# EAGLE design toaster_brain (EAGLE 5.11)
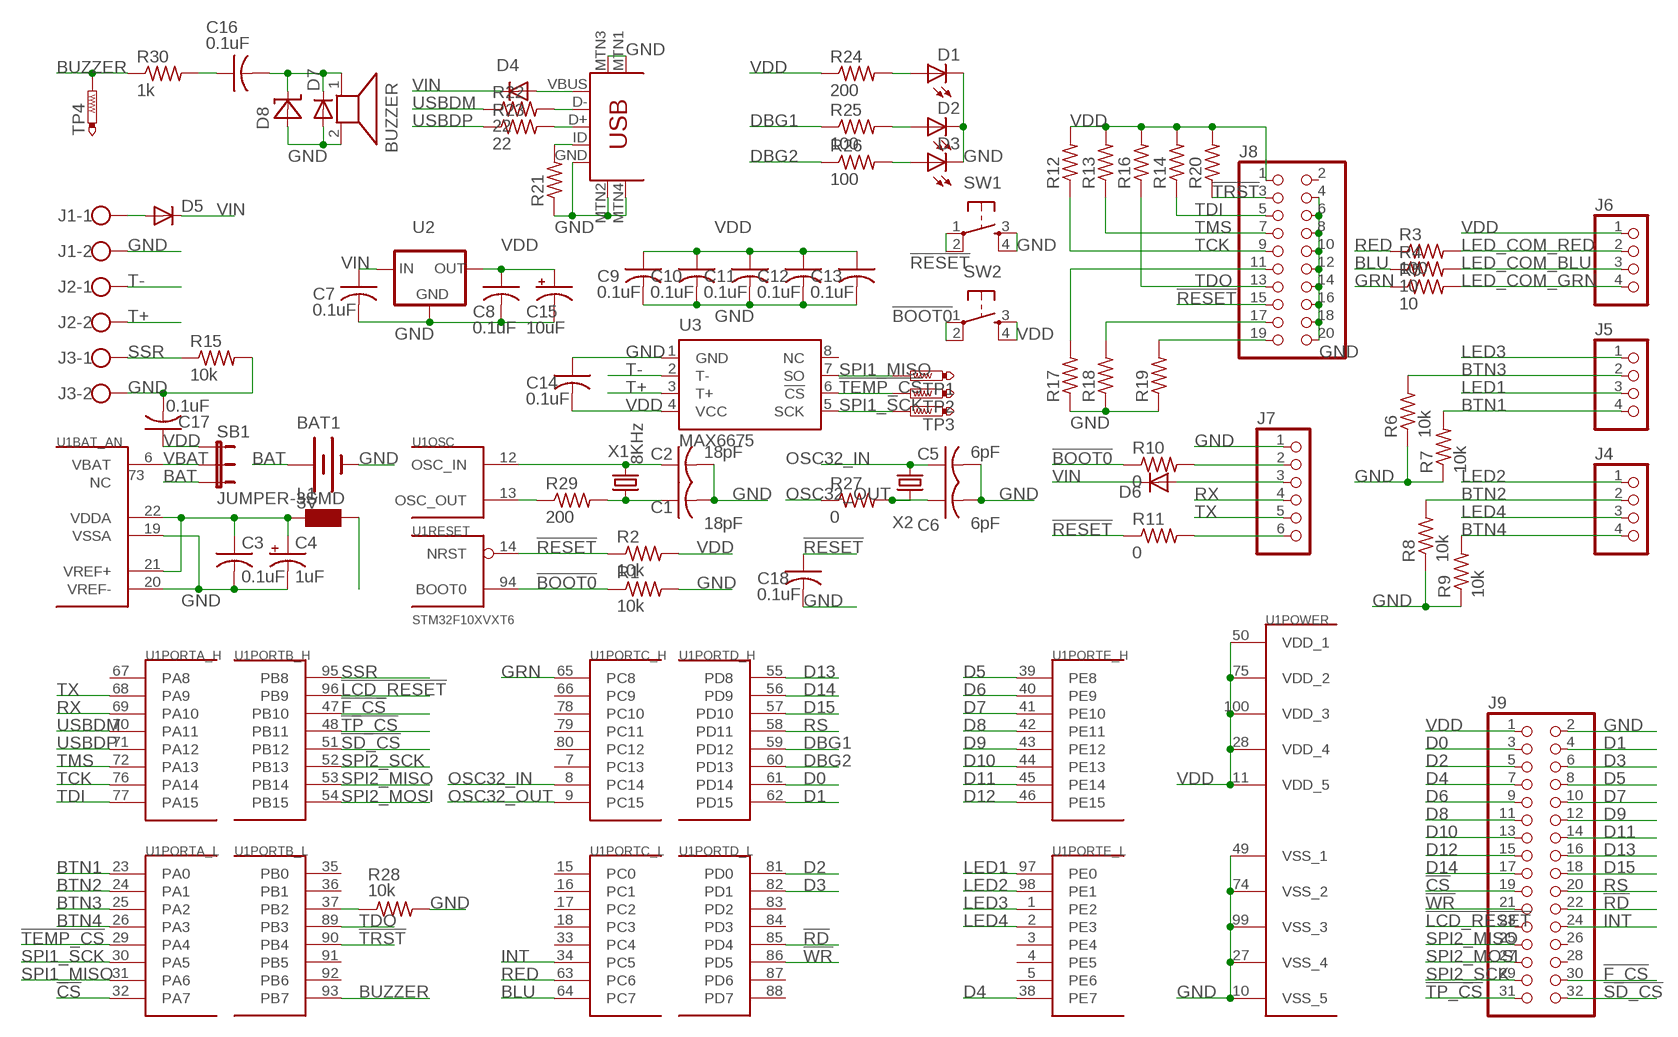
[diagram p0: schematic, sheet 1]

## Parts
BAT1  3V  BATTERY12MM  [BATTCON_12MM]
BUZZER  AST1628MATRQ  [AST1628MATRQ]
C1  18pF  C-USC0603  [C0603]
C2  18pF  C-USC0603  [C0603]
C3  0.1uF  C-USC0603  [C0603]
C4  1uF  CPOL-USSMCP  [SMC_P]
C5  6pF  C-USC0603  [C0603]
C6  6pF  C-USC0603  [C0603]
C7  0.1uF  C-USC0603  [C0603]
C8  0.1uF  C-USC0603  [C0603]
C9  0.1uF  C-USC0603  [C0603]
C10  0.1uF  C-USC0603  [C0603]
C11  0.1uF  C-USC0603  [C0603]
C12  0.1uF  C-USC0603  [C0603]
C13  0.1uF  C-USC0603  [C0603]
C14  0.1uF  C-USC0603  [C0603]
C15  10uF  CPOL-USB/3528-21R  [B/3528-21R]
C16  0.1uF  C-USC0603  [C0603]
C17  0.1uF  C-USC0603  [C0603]
C18  0.1uF  C-USC0603  [C0603]
D1  LEDCHIP-LED0603  [CHIP-LED0603]
D2  LEDCHIP-LED0603  [CHIP-LED0603]
D3  LEDCHIP-LED0603  [CHIP-LED0603]
D4  DIODE-SOD323-R  [SOD323-R]
D5  DIODE-SOD323-R  [SOD323-R]
D6  DIODE-SOD323-R  [SOD323-R]
D7  DIODE-SOD123  [SOD123]
D8  ZDIODE  [SOD123@2]
J1  W237-102  [W237-102]
J2  W237-102  [W237-102]
J3  W237-102  [W237-102]
J4  PINHD-1X4  [1X04]
J5  PINHD-1X4  [1X04]
J6  PINHD-1X4  [1X04]
J7  PINHD-1X6  [1X06]
J8  PINHD-2X10  [2X10]
J9  PINHD-2X16  [2X16]
J10  USB-MINIB-5PIN  [USB-MINIB]
L1  WE-CBF_0603  [0603]
R1  10k  R-US_R0603  [R0603]
R2  10k  R-US_R0603  [R0603]
R3  100  R-US_R0603  [R0603]
R4  10  R-US_R0603  [R0603]
R5  10  R-US_R0603  [R0603]
R6  10k  R-US_R0603  [R0603]
R7  10k  R-US_R0603  [R0603]
R8  10k  R-US_R0603  [R0603]
R9  10k  R-US_R0603  [R0603]
R10  0  R-US_R0603  [R0603]
R11  0  R-US_R0603  [R0603]
R12  10k  R-US_R0603  [R0603]
R13  10k  R-US_R0603  [R0603]
R14  10k  R-US_R0603  [R0603]
R15  10k  R-US_R0603  [R0603]
R16  10k  R-US_R0603  [R0603]
R17  10k  R-US_R0603  [R0603]
R18  10k  R-US_R0603  [R0603]
R19  10k  R-US_R0603  [R0603]
R20  10k  R-US_R0603  [R0603]
R21  10k  R-US_R0603  [R0603]
R22  22  R-US_R0603  [R0603]
R23  22  R-US_R0603  [R0603]
R24  200  R-US_R0603  [R0603]
R25  100  R-US_R0603  [R0603]
R26  100  R-US_R0603  [R0603]
R27  0  R-US_R0603  [R0603]
R28  10k  R-US_R0603  [R0603]
R29  200  R-US_R0603  [R0603]
R30  1k  R-US_R0603  [R0603]
SB1  JUMPER-3SMD  [SJ_3]
SW1  TAC_SWITCHSMD  [TACTILE_SWITCH_SMD]
SW2  TAC_SWITCHSMD  [TACTILE_SWITCH_SMD]
TP1  PTR1TP07R  [TP07R]
TP2  PTR1TP07R  [TP07R]
TP3  PTR1TP07R  [TP07R]
TP4  PTR1TP07R  [TP07R]
U1  STM32F10XVXT6  [TQFP100]
U2  LP2950CDT-3.3  [DPACK]
U3  MAX6675  [SO08]
X1  8KHz  CRYSTALCTS406  [CTS406]
X2  MC-306  [MC-306]

## Nets
!BOOT0: R1.1 R10.1 SW2.1 SW2.2 U1.94(RESET:BOOT0)
!CS: J9.19 U1.32(PORTA_L:PA7)
!F_CS: J9.30 U1.47(PORTB_H:PB10)
!LCD_RESET: J9.23 U1.96(PORTB_H:PB9)
!RD: J9.22 U1.85(PORTD_L:PD4)
!RESET: C18.1 J8.15 R2.1 R11.1 SW1.1 SW1.2 U1.14(RESET:NRST)
!SD_CS: J9.32 U1.51(PORTB_H:PB12)
!TEMP_CS: TP2.TP U1.29(PORTA_L:PA4) U3.6(!CS)
!TP_CS: J9.31 U1.48(PORTB_H:PB11)
!TRST: J8.3 R20.1 U1.90(PORTB_L:PB4)
!WR: J9.21 U1.86(PORTD_L:PD5)
BAT: BAT1.PWR@1(+) SB1.3
BLU: R4.1 U1.64(PORTC_L:PC7)
BTN1: J5.4 R7.2 U1.23(PORTA_L:PA0)
BTN2: J4.2 R8.2 U1.24(PORTA_L:PA1)
BTN3: J5.2 R6.2 U1.25(PORTA_L:PA2)
BTN4: J4.4 R9.2 U1.26(PORTA_L:PA3)
BUZZER: R30.1 TP4.TP U1.93(PORTB_L:PB7)
D0: J9.3 U1.61(PORTD_H:PD14)
D1: J9.4 U1.62(PORTD_H:PD15)
D2: J9.5 U1.81(PORTD_L:PD0)
D3: J9.6 U1.82(PORTD_L:PD1)
D4: J9.7 U1.38(PORTE_L:PE7)
D5: J9.8 U1.39(PORTE_H:PE8)
D6: J9.9 U1.40(PORTE_H:PE9)
D7: J9.10 U1.41(PORTE_H:PE10)
D8: J9.11 U1.42(PORTE_H:PE11)
D9: J9.12 U1.43(PORTE_H:PE12)
D10: J9.13 U1.44(PORTE_H:PE13)
D11: J9.14 U1.45(PORTE_H:PE14)
D12: J9.15 U1.46(PORTE_H:PE15)
D13: J9.16 U1.55(PORTD_H:PD8)
D14: J9.17 U1.56(PORTD_H:PD9)
D15: J9.18 U1.57(PORTD_H:PD10)
DBG1: R25.1 U1.59(PORTD_H:PD12)
DBG2: R26.1 U1.60(PORTD_H:PD13)
GND: BAT1.GND(-) BUZZER.2 C1.2 C2.2 C3.2 C4.- C5.2 C6.2 C7.2 C8.2 C9.2 C10.2 C11.2 C12.2 C13.2 C14.1 C15.- C17.2 C18.2 D1.C D2.C D3.C D7.A D8.A J1.2 J3.2 J7.1 J8.4 J8.6 J8.8 J8.10 J8.12 J8.14 J8.16 J8.18 J8.20 J9.2 J10.GND J10.MTN1(MTN2) J10.MTN2(MTN3) J10.MTN3(MTN1) J10.MTN4 R1.2 R6.1 R7.1 R8.1 R9.1 R15.2 R17.1 R18.1 R19.1 R21.1 R28.2 SW1.3 SW1.4 U1.10(POWER:VSS_5) U1.19(BAT_AN:VSSA) U1.20(BAT_AN:VREF-) U1.27(POWER:VSS_4) U1.49(POWER:VSS_1) U1.74(POWER:VSS_2) U1.99(POWER:VSS_3) U2.4(GND) U3.1(GND)
GRN: R5.1 U1.65(PORTC_H:PC8)
INT: J9.24 U1.34(PORTC_L:PC5)
LED1: J5.3 U1.97(PORTE_L:PE0)
LED2: J4.1 U1.98(PORTE_L:PE1)
LED3: J5.1 U1.1(PORTE_L:PE2)
LED4: J4.3 U1.2(PORTE_L:PE3)
LED_COM_BLU: J6.3 R4.2
LED_COM_GRN: J6.4 R5.2
LED_COM_RED: J6.2 R3.2
N$1: C1.1 R29.2 X1.1
N$2: C2.1 U1.12(OSC:OSC_IN) X1.3
N$3: J7.2 R10.2
N$4: J7.6 R11.2
N$6: J8.11 R17.2
N$7: J8.17 R18.2
N$8: J8.19 R19.2
N$9: J10.ID R21.2
N$10: J10.D- R22.2
N$11: J10.D+ R23.2
N$13: D1.A R24.2
N$14: D2.A R25.2
N$15: D3.A R26.2
N$16: C6.1 R27.2 X2.1
N$19: R28.1 U1.37(PORTB_L:PB2)
N$20: D4.A J10.VBUS
N$21: D5.A J1.1
N$22: D6.A J7.3
N$23: R29.1 U1.13(OSC:OSC_OUT)
N$24: C16.1 R30.2
N$25: C3.1 C4.+ L1.1 U1.21(BAT_AN:VREF+) U1.22(BAT_AN:VDDA)
N$27: BUZZER.1 C16.2 D7.C D8.C
OSC32_IN: C5.1 U1.8(PORTC_H:PC14) X2.4
OSC32_OUT: R27.1 U1.9(PORTC_H:PC15)
RED: R3.1 U1.63(PORTC_L:PC6)
RS: J9.20 U1.58(PORTD_H:PD11)
RX: J7.4 U1.69(PORTA_H:PA10)
SPI1_MISO: TP1.TP U1.31(PORTA_L:PA6) U3.7(SO)
SPI1_SCK: TP3.TP U1.30(PORTA_L:PA5) U3.5(SCK)
SPI2_MISO: J9.25 U1.53(PORTB_H:PB14)
SPI2_MOSI: J9.27 U1.54(PORTB_H:PB15)
SPI2_SCK: J9.29 U1.52(PORTB_H:PB13)
SSR: J3.1 R15.1 U1.95(PORTB_H:PB8)
T+: J2.2 U3.3(T+)
T-: J2.1 U3.2(T-)
TCK: J8.9 R12.1 U1.76(PORTA_H:PA14)
TDI: J8.5 R14.1 U1.77(PORTA_H:PA15)
TDO: J8.13 R16.1 U1.89(PORTB_L:PB3)
TMS: J8.7 R13.1 U1.72(PORTA_H:PA13)
TX: J7.5 U1.68(PORTA_H:PA9)
USBDM: R22.1 U1.70(PORTA_H:PA11)
USBDP: R23.1 U1.71(PORTA_H:PA12)
VBAT: SB1.2 U1.6(BAT_AN:VBAT)
VDD: C8.1 C9.1 C10.1 C11.1 C12.1 C13.1 C14.2 C15.+ C17.1 J6.1 J8.1 J9.1 L1.2 R2.2 R12.2 R13.2 R14.2 R16.2 R20.2 R24.1 SB1.1 SW2.3 SW2.4 U1.11(POWER:VDD_5) U1.28(POWER:VDD_4) U1.50(POWER:VDD_1) U1.75(POWER:VDD_2) U1.100(POWER:VDD_3) U2.3(OUT) U3.4(VCC)
VIN: C7.1 D4.C D5.C D6.C U2.1(IN)
Unconnected: J8.2 J9.26 J9.28 U1.3(PORTE_L:PE4) U1.4(PORTE_L:PE5) U1.5(PORTE_L:PE6) U1.7(PORTC_H:PC13) U1.15(PORTC_L:PC0) U1.16(PORTC_L:PC1) U1.17(PORTC_L:PC2) U1.18(PORTC_L:PC3) U1.33(PORTC_L:PC4) U1.35(PORTB_L:PB0) U1.36(PORTB_L:PB1) U1.66(PORTC_H:PC9) U1.67(PORTA_H:PA8) U1.73(BAT_AN:NC) U1.78(PORTC_H:PC10) U1.79(PORTC_H:PC11) U1.80(PORTC_H:PC12) U1.83(PORTD_L:PD2) U1.84(PORTD_L:PD3) U1.87(PORTD_L:PD6) U1.88(PORTD_L:PD7) U1.91(PORTB_L:PB5) U1.92(PORTB_L:PB6) U3.8(NC)

## Library data of the parts
BAT1 = SparkFun:BATTERY: Battery Holders Various common sizes : AA, AAA, 20mm coin cell and 12mm coin cell.
BUZZER = piezo:AST1628MATRQ: Audio Indicators & Alerts 3MM HEIGHT 4000HZ 85DB Datasheet <http://www.mallory-sonalert.com/specifications/AST1628MATRQ.pdf>
C1-C3 C5-C14 C16-C18 = rcl:C-US: CAPACITOR, American symbol
C4 C15 = rcl:CPOL-US: POLARIZED CAPACITOR, American symbol
D1-D3 = led:LED: LED OSRAM: - CHIPLED LG R971, LG N971, LY N971, LG Q971, LY Q971, LO R971, LY R971 LH N974, LH R974 LS Q976, LO Q976, LY Q976 LO Q996 - Hyper CHIPLED LW Q18S LB Q993, LB Q99A, LB R99A - SideLED LS A670, LO A670, LY A670, LG A670, LP A670 LB A673, LV A673, LT A673, LW A673 LH A674 LY A675 LS A676, LA A676, LO A676, LY A676, LW A676 LS A679, LY A679, LG A679 - Hyper Micro SIDELED® LS Y876, LA Y876, LO Y876, LY Y876 LT Y87S - SmartLED LW L88C, LW L88S LB L89C, LB L89S, LG L890 LS L89K, LO L89K, LY L89K LS L896, LA L896, LO L896, LY L896 - TOPLED LS T670, LO T670, LY T670, LG T670, LP T670 LSG T670, LSP T670, LSY T670, LOP T670, LYG T670 LG T671, LOG T671, LSG T671 LB T673, LV T673, LT T673, LW T673 LH T674 LS T676, LA T676, LO T676, LY T676, LB T676, LH T676, LSB T676, LW T676 LB T67C, LV T67C, LT T67C, LS T67K, LO T67K, LY T67K, LW E67C LS E67B, LA E67B, LO E67B, LY E67B, LB E67C, LV E67C, LT E67C LW T67C LS T679, LY T679, LG T679 LS T770, LO T770, LY T770, LG T770, LP T770 LB T773, LV T773, LT T773, LW T773 LH T774 LS E675, LA E675, LY E675, LS T675 LS T776, LA T776, LO T776, LY T776, LB T776 LHGB T686 LT T68C, LB T68C - Hyper Mini TOPLED® LB M676 - Mini TOPLED Santana® LG M470 LS M47K, LO M47K, LY M47K Source: http://www.osram.convergy.de LUXEON: - LUMILED® LXK2-PW12-R00, LXK2-PW12-S00, LXK2-PW14-U00, LXK2-PW14-V00 LXK2-PM12-R00, LXK2-PM12-S00, LXK2-PM14-U00 LXK2-PE12-Q00, LXK2-PE12-R00, LXK2-PE12-S00, LXK2-PE14-T00, LXK2-PE14-U00 LXK2-PB12-K00, LXK2-PB12-L00, LXK2-PB12-M00, LXK2-PB14-N00, LXK2-PB14-P00, LXK2-PB14-Q00 LXK2-PR12-L00, LXK2-PR12-M00, LXK2-PR14-Q00, LXK2-PR14-R00 LXK2-PD12-Q00, LXK2-PD12-R00, LXK2-PD12-S00 LXK2-PH12-R00, LXK2-PH12-S00 LXK2-PL12-P00, LXK2-PL12-Q00, LXK2-PL12-R00 Source: www.luxeon.com KINGBRIGHT: KA-3528ASYC Source: www.kingbright.com
D4-D7 = diode:DIODE-: DIODE
D8 = diode:ZDIODE
J1-J3 = con-wago-500:W237-102: WAGO SCREW CLAMP; MPN: 237-102; OC_FARNELL: unknown; OC_NEWARK: 70K9898
J4-J6 = pinhead:PINHD-1X4: PIN HEADER
J7 = pinhead:PINHD-1X6: PIN HEADER
J8 = pinhead:PINHD-2X10: PIN HEADER
J9 = pinhead:PINHD-2X16: PIN HEADER
J10 = SparkFun:USB-MINIB: Mini-USB "B" connector with 5th pin broken out. Created new symbol breaking out 5th "ID" pin in mini/micro USB connector spec. See: http://en.wikipedia.org/wiki/Mini_usb#Cables. Uses same footprint as 4-pin symbol. Also added pins to connect to mounting / shield pads if required (probably not generally needed as signals aren't shielded once they leave the connector).
L1 = wuerth-elektronik:WE-CBF: SMD EMI Suppression Ferrite Beads - excellent anti-EMI properties - low DCR - impedances till 3000 ohms - rated current up to 6 A
R1-R30 = resistor:R-US_: RESISTOR, American symbol
SB1 = SparkFun:JUMPER-3
SW1 SW2 = SparkFun:TAC_SWITCH: Momentary Switch Button commonly used for reset or general input. Spark Fun Electronics SKU : COM-00097
TP1-TP4 = testpad:PTR1: TEST PIN
U1 = stm32:STM32F10XVXT6: STM32F101/103 100 pin LQFP
U2 = v-reg:LP2950?*: Source: http://cache.national.com/ds/LP/LP2950.pdf
U3 = maxim:MAX6675
X1 = crystal:CRYSTAL: CRYSTAL; OC_FARNELL: unknown; OC_NEWARK: unknown
X2 = crystal:MC-306: kHz RANGE CRYSTAL UNIT SMD Source: MC-306_405_406_E07X.PDF Homepage <www.epsontoyocom.co.jp>; MPN: MC-306 60.0KHZ 100PPM ,12.5PF; OC_FARNELL: 1278040; OC_NEWARK: 31M5576

## Board
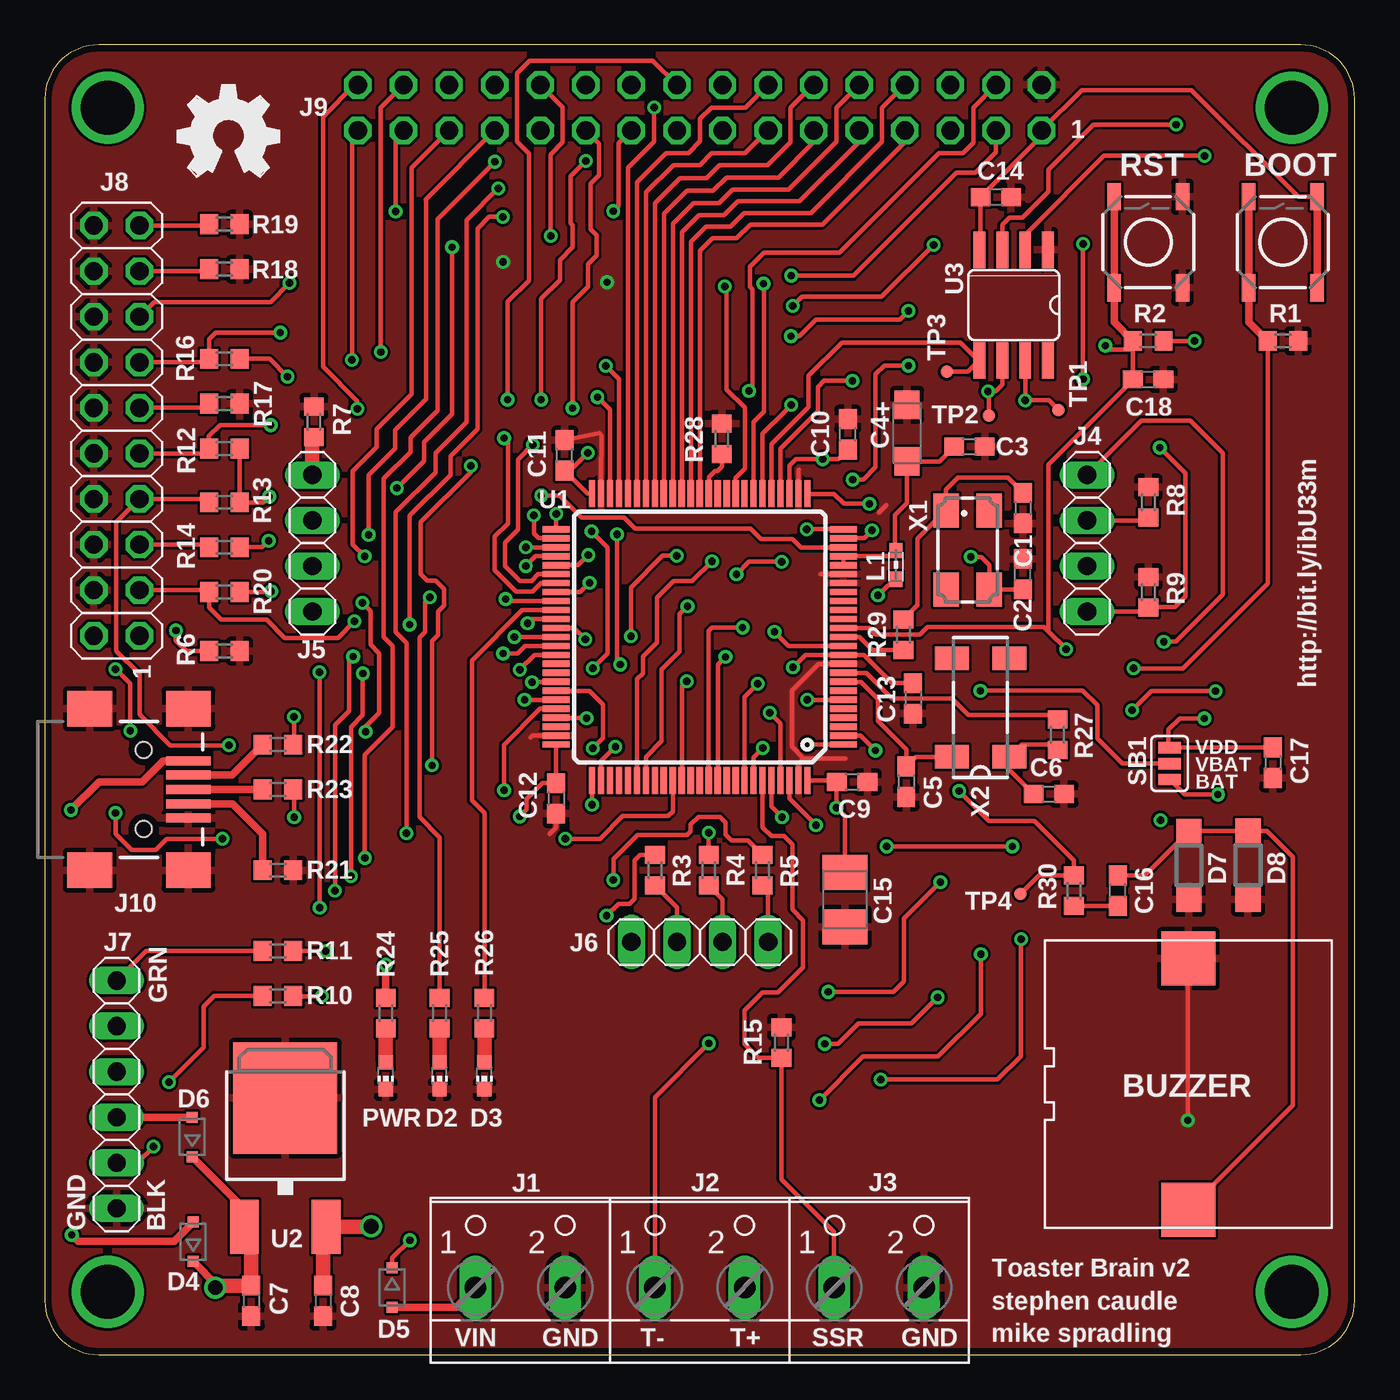
[diagram p1: board, top side]
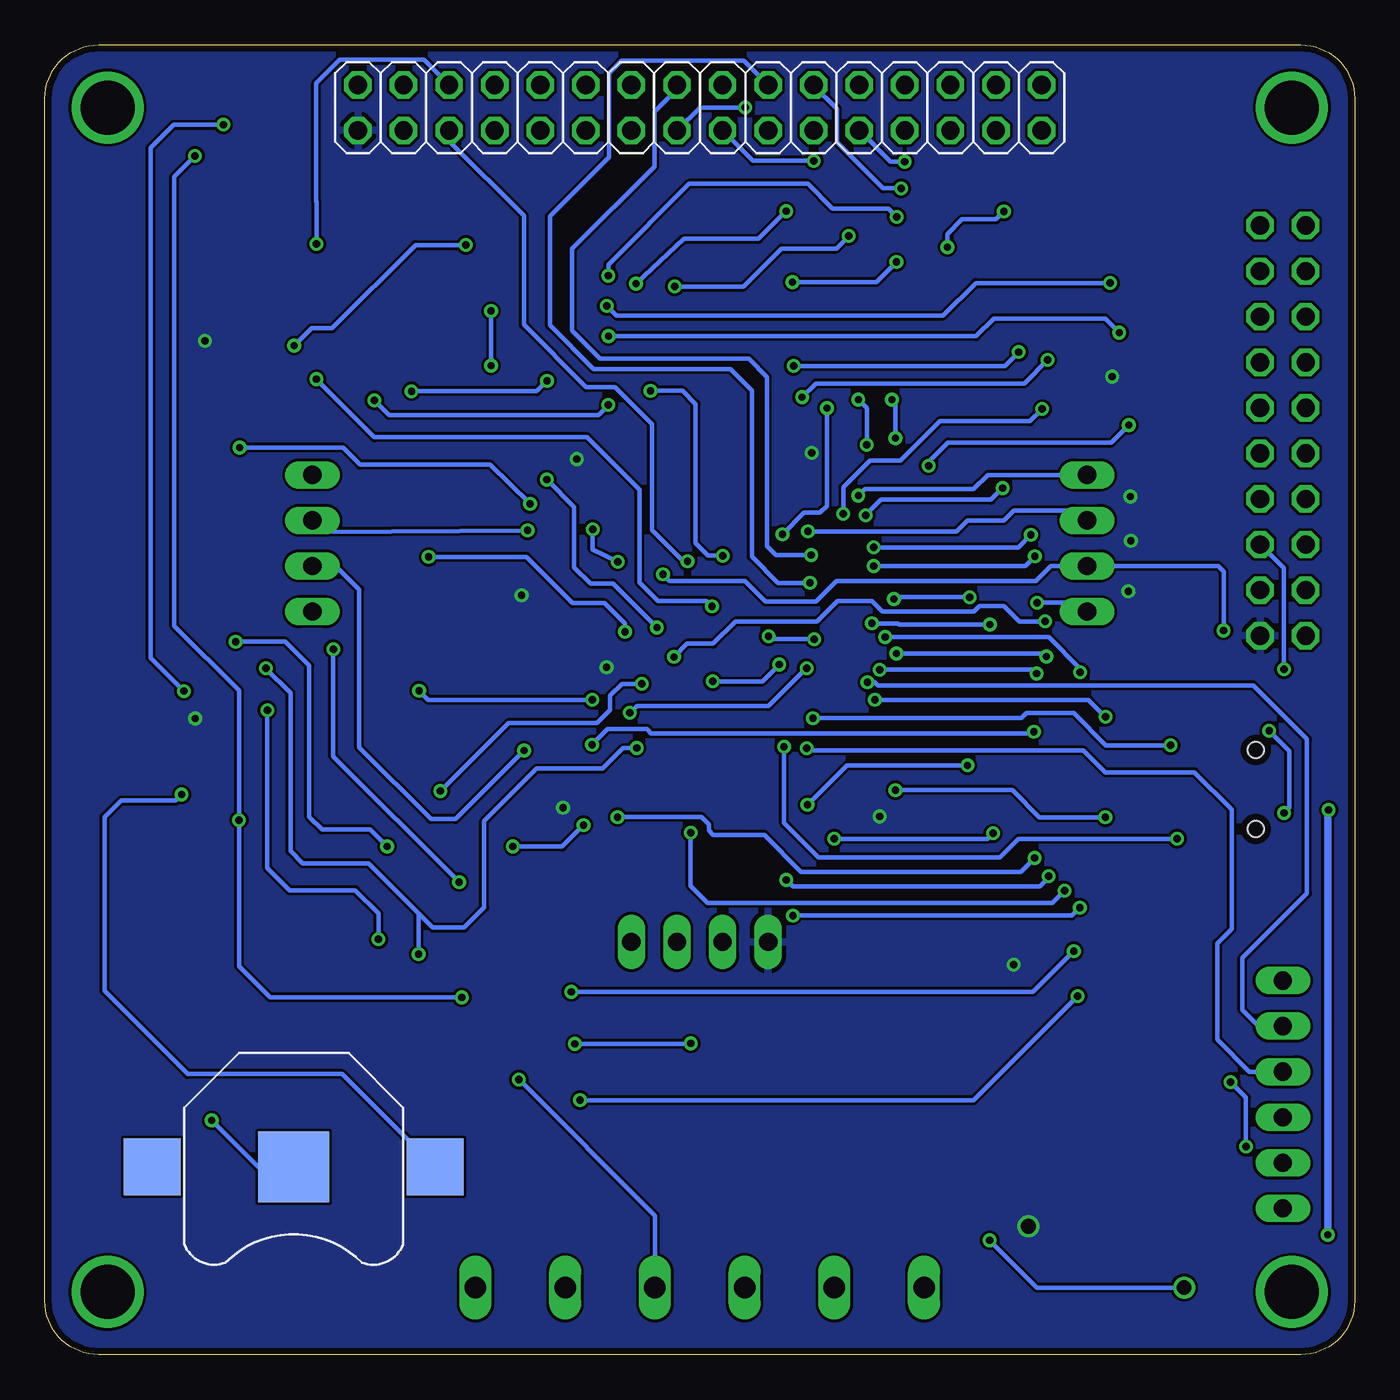
[diagram p2: board, bottom side, seen from below]

Size 73 x 73 mm. Coordinates in mm from the lower left corner, seen from the top.
Outline: 70,0 arc90 73,3 73,70 arc90 70,73 3,73 arc90 0,70 0,3 arc90 3,0 70,0
Copper layers (1*16): Top 0.0356mm / dielectric 1.5011mm / Bottom 0.0356mm
Design rules "LaenPCBOrder *": minimum track width 6mil, minimum drill 13mil, track to track 6mil, track to pad 6mil, pad to pad 6mil, via to via 6mil, smd to smd 6mil, copper to edge 15mil, drill to drill 6mil, minimum pad ring 7mil, minimum via ring 7mil, stop-mask expansion 4mil, vias tented up to drill 18mil, thermal gap 10mil

### Footprints (pad centres in the part's own frame; a part is rotated, then mirrored left to right if it is on the bottom)
BATTCON_12MM = smd 3.962 x 3.962: GND 0,0 | smd 3.175 x 3.175: PWR@1 -7.874,0; PWR@2 7.874,0
AST1628MATRQ = smd 3 x 3: 1 0,7; 2 0,-7
C0603 = smd 1.1 x 1: 1 -0.85,0; 2 0.85,0
SMC_P = smd 1.6 x 1.4: + -1.575,0; - 1.575,0
B/3528-21R = smd 1.95 x 2.5: + 1.525,0; - -1.525,0
CHIP-LED0603 = smd 0.8 x 0.8: A 0,-0.75; C 0,0.75
SOD323-R = smd 0.6 x 0.6: A 1.1,0; C -1.1,0
SOD123 = smd 1.4 x 1.4: A 1.9,0; C -1.9,0
SOD123@2 = smd 1.4 x 1.4: A 1.9,0; C -1.9,0
W237-102 = drill 1.194 long: 1 -2.5,-1.27; 2 2.5,-1.27
1X04 = drill 1.016 long: 1 -3.81,0; 2 -1.27,0; 3 1.27,0; 4 3.81,0
1X06 = drill 1.016 long: 1 -6.35,0; 2 -3.81,0; 3 -1.27,0; 4 1.27,0; 5 3.81,0; 6 6.35,0
2X10 = drill 1.016 octagon: 1 -11.43,-1.27; 2 -11.43,1.27; 3 -8.89,-1.27; 4 -8.89,1.27; 5 -6.35,-1.27; 6 -6.35,1.27; 7 -3.81,-1.27; 8 -3.81,1.27; 9 -1.27,-1.27; 10 -1.27,1.27; 11 1.27,-1.27; 12 1.27,1.27; 13 3.81,-1.27; 14 3.81,1.27; 15 6.35,-1.27; 16 6.35,1.27; 17 8.89,-1.27; 18 8.89,1.27; 19 11.43,-1.27; 20 11.43,1.27
2X16 = drill 1.016 octagon: 1 -19.05,-1.27; 2 -19.05,1.27; 3 -16.51,-1.27; 4 -16.51,1.27; 5 -13.97,-1.27; 6 -13.97,1.27; 7 -11.43,-1.27; 8 -11.43,1.27; 9 -8.89,-1.27; 10 -8.89,1.27; 11 -6.35,-1.27; 12 -6.35,1.27; 13 -3.81,-1.27; 14 -3.81,1.27; 15 -1.27,-1.27; 16 -1.27,1.27; 17 1.27,-1.27; 18 1.27,1.27; 19 3.81,-1.27; 20 3.81,1.27; 21 6.35,-1.27; 22 6.35,1.27; 23 8.89,-1.27; 24 8.89,1.27; 25 11.43,-1.27; 26 11.43,1.27; 27 13.97,-1.27; 28 13.97,1.27; 29 16.51,-1.27; 30 16.51,1.27; 31 19.05,-1.27; 32 19.05,1.27
USB-MINIB = smd 2.5 x 0.5: D+ 2.5,0; D- 2.5,0.8; GND 2.5,-1.6; ID 2.5,-0.8; VBUS 2.5,1.6 | smd 2.5 x 2: MTN1 -3,4.5; MTN2 2.5,4.5; MTN3 -3,-4.5; MTN4 2.5,-4.5 | hole 0.9: 0,2.2; 0,-2.2
0603 = smd 0.85 x 0.7: 1 -0.9,0; 2 0.7,0
R0603 = smd 1 x 1.1: 1 -0.85,0; 2 0.85,0
SJ_3 = smd 0.635 x 1.27: 1 -0.889,0; 2 0,0; 3 0.889,0
TACTILE_SWITCH_SMD = smd 1.524 x 0.762: 1 -2.54,1.905; 2 2.54,1.905; 3 -2.54,-1.905; 4 2.54,-1.905
TP07R = smd 0.7 x 0.7: TP 0,0
TQFP100 = smd 1.5 x 0.347: 1 -8,6; 2 -8,5.5; 3 -8,5; 4 -8,4.5; 5 -8,4; 6 -8,3.5; 7 -8,3; 8 -8,2.5; 9 -8,2; 10 -8,1.5; 11 -8,1; 12 -8,0.5; 13 -8,0; 14 -8,-0.5; 15 -8,-1; 16 -8,-1.5; 17 -8,-2; 18 -8,-2.5; 19 -8,-3; 20 -8,-3.5; 21 -8,-4; 22 -8,-4.5; 23 -8,-5; 24 -8,-5.5; 25 -8,-6; 51 8,-6; 52 8,-5.5; 53 8,-5; 54 8,-4.5; 55 8,-4; 56 8,-3.5; 57 8,-3; 58 8,-2.5; 59 8,-2; 60 8,-1.5; 61 8,-1; 62 8,-0.5; 63 8,0; 64 8,0.5; 65 8,1; 66 8,1.5; 67 8,2; 68 8,2.5; 69 8,3; 70 8,3.5; 71 8,4; 72 8,4.5; 73 8,5; 74 8,5.5; 75 8,6 | smd 0.347 x 1.5: 26 -6,-8; 27 -5.5,-8; 28 -5,-8; 29 -4.5,-8; 30 -4,-8; 31 -3.5,-8; 32 -3,-8; 33 -2.5,-8; 34 -2,-8; 35 -1.5,-8; 36 -1,-8; 37 -0.5,-8; 38 0,-8; 39 0.5,-8; 40 1,-8; 41 1.5,-8; 42 2,-8; 43 2.5,-8; 44 3,-8; 45 3.5,-8; 46 4,-8; 47 4.5,-8; 48 5,-8; 49 5.5,-8; 50 6,-8; 76 6,8; 77 5.5,8; 78 5,8; 79 4.5,8; 80 4,8; 81 3.5,8; 82 3,8; 83 2.5,8; 84 2,8; 85 1.5,8; 86 1,8; 87 0.5,8; 88 0,8; 89 -0.5,8; 90 -1,8; 91 -1.5,8; 92 -2,8; 93 -2.5,8; 94 -3,8; 95 -3.5,8; 96 -4,8; 97 -4.5,8; 98 -5,8; 99 -5.5,8; 100 -6,8
DPACK = smd 1.6 x 3: 1 -2.28,-4.8; 3 2.28,-4.8 | smd 5.8 x 6.2: 4 0,2.38
SO08 = smd 0.66 x 2.032: 1 -1.905,-3.073; 2 -0.635,-3.073; 3 0.635,-3.073; 4 1.905,-3.073; 5 1.905,3.073; 6 0.635,3.073; 7 -0.635,3.073; 8 -1.905,3.073
CTS406 = smd 1.9 x 1.4: 1 -2.2,-1.2; 2 2.2,-1.2; 3 2.2,1.2; 4 -2.2,1.2
MC-306 = smd 1.3 x 1.9: 1 -2.75,-1.6; 2 2.75,-1.6; 3 2.75,1.6; 4 -2.75,1.6

### Placement (x,y rotation side)
BAT1  59.13,10.46 180 bottom
BUZZER  63.73,15.07 180 top
C1  54.5,47.18 270 top
C2  54.5,43.5 90 top
C3  51.53,50.6 0 top
C4  48.05,51.36 90 top
C5  48.01,31.93 270 top
C6  55.96,31.24 0 top
C7  11.5,3 270 top
C8  15.5,3 270 top
C9  45,31.93 0 top
C10  44.75,51.29 90 top
C11  28.97,50.12 90 top
C12  28.5,31 270 top
C13  48.39,36.58 270 top
C14  53,64.5 180 top
C15  44.59,25.36 90 top
C16  59.79,25.86 90 top
C17  68.43,32.99 270 top
C18  61.49,54.36 0 top
D1  19,15.54 180 top
D2  22,15.54 180 top
D3  24.5,15.54 180 top
D4  8.27,6.3 90 top
D5  19.35,3.75 270 top
D6  8.22,12.13 90 top
D7  63.75,27.27 270 top
D8  67.06,27.28 270 top
J1  26.5,5 0 top
J2  36.5,5 0 top
J3  46.5,5 0 top
J4  58.09,45.23 270 top
J5  14.91,45.23 90 top
J6  36.5,23 0 top
J7  4,14.5 90 top
J8  4,51.5 90 top
J9  36.5,69.5 0 bottom
J10  5.5,31.5 0 top
L1  47.43,43.92 270 top
R1  69,56.5 0 top
R2  61.5,56.5 0 top
R3  34,27 270 top
R4  37,27 270 top
R5  40,27 270 top
R6  10,39.22 180 top
R7  15,52 270 top
R8  61.5,47.5 270 top
R9  61.5,42.5 270 top
R10  13,20 180 top
R11  13,22.5 180 top
R12  10,50.5 0 top
R13  10,47.5 0 top
R14  10,45 0 top
R15  41.06,17.4 90 top
R16  10,55.5 0 top
R17  10,53 180 top
R18  10,60.5 180 top
R19  10,63 180 top
R20  10,42.5 0 top
R21  13,27 180 top
R22  13,34 180 top
R23  13,31.5 180 top
R24  19,19.04 270 top
R25  22,19.04 270 top
R26  24.5,19.04 270 top
R27  56.44,34.54 270 top
R28  37.73,51.04 90 top
R29  47.85,40.13 90 top
R30  57.35,25.86 270 top
SB1  62.69,32.94 270 top
SW1  61.5,62 90 top
SW2  69,62 90 top
TP1  56.49,52.65 0 top
TP2  52.63,52.35 0 top
TP3  50.27,54.79 0 top
TP4  54.38,25.68 0 top
U1  36.5,40 180 top
U2  13.4,11.92 0 top
U3  54,58.5 180 top
U$1  [OSHW_FILLX200_NOTEXT]  7.39,65.66 0 top
X1  51.43,44.85 270 top
X2  52.15,36.07 90 top

### Tracks (layer width: path | path; a pad name or v marks a point on that pad's centre or on a via)
!BOOT0  (via drill 0.41)
  Top 0.254: R10.1 13.87,19.98 v15.44,19.98 | v60.68,38.25 63.42,38.25 68.15,42.98 R1.1 | U1.94 39.5,33.29 v40.02,33.81 | v52.17,22.33 52.17,19 49.78,16.61 45.59,16.61 v43.17,14.19
  Top 0.406: R1.1 67.09,57.55 SW2.1 SW2.2
  Bottom 0.254: v60.68,38.25 59.31,36.88 59.31,28.07 58.62,27.38 54.97,27.38 52.17,24.59 | v15.44,19.98 21.23,14.19 v43.17,14.19 | v40.02,33.81 40.77,33.81 41.91,32.66 45.59,32.66 48.51,29.74 48.51,24.92 49.63,23.8 51.38,23.8 52.17,24.59 | v52.17,22.33 52.17,24.59
!CS  (via drill 0.41)
  Top 0.254: U1.32 39.5,51.97 40.08,52.55 40.08,59.66 v40.06,59.69 | v31.69,63.73 31.98,64.02 31.98,67.51 J9.19
  Bottom 0.254: v31.69,63.73 33.22,62.19 37.38,62.19 v40.06,59.69
!F_CS  (via drill 0.41)
  Top 0.254: J9.30 18.72,69.5 v18.72,55.88 | U1.47 32,54.37 v31.27,55.1
  Bottom 0.254: v31.27,55.1 19.49,55.1 v18.72,55.88
!LCD_RESET  (via drill 0.41)
  Top 0.254: v25.08,66.48 21.89,63.3 21.89,52.63 20.37,51.1 20.37,50.3 18.89,48.82 18.89,39.99 19.39,39.48 19.39,34.99 17.83,33.43 v17.83,27.69 | v41.08,29.96 40.5,30.54 U1.96
  Bottom 0.254: J9.23 25.86,66.48 v25.08,66.48 | v41.08,29.96 36.4,29.96 35.99,29.55 35.99,29.21 35.75,28.97 32.91,28.97 30.85,26.91 18.61,26.91 v17.83,27.69
!RD  (via drill 0.41)
  Top 0.254: v20.16,29.06 20.16,39.67 19.55,40.28 19.55,46.95 21.77,49.17 21.77,50.25 23.5,51.98 23.5,63.22 v25.27,65 | U1.85 35,30.28 34.73,30.01 32.21,30.01 30.95,28.75 v29.01,28.75
  Bottom 0.254: J9.22 30.15,70.73 28.87,69.44 28.87,67.58 26.29,65 v25.27,65 | v29.01,28.75 20.46,28.75 v20.16,29.06
!RESET  (via drill 0.41)
  Top 0.254: 60.55,56.4 R2.1 60.65,56.01 | R11.1 v15.65,22.49 | v41.68,58.45 42.19,58.95 46.63,58.95 v49.53,61.85 | v13.63,59.73 12.57,58.67 6.1,58.67 J8.15 | 60.65,56.01 C18.1 60.64,54.31 55.94,49.61 55.94,40.3 | v59.11,56.24 59.33,56.01 60.65,56.01 | v43.66,20.22 47.3,20.22 47.88,20.8 47.88,24.31 v49.91,26.34 | U1.14 44.51,40.49 45.95,40.49 46.3,40.13 48.77,40.13 49.2,40.56 55.68,40.56 55.94,40.3 | v56.92,39.32 55.94,40.3
  Top 0.406: R2.1 59.59,57.55 SW1.1 SW1.2
  Bottom 0.254: v13.63,59.73 21.12,59.73 22.94,57.91 41.15,57.91 v41.68,58.45 | v15.65,22.49 17.92,20.22 v43.66,20.22 | v49.53,61.85 52.35,61.85 57,57.2 58.14,57.2 v59.11,56.24 | v56.92,39.32 56.92,33.35 v49.91,26.34
!SD_CS  (via drill 0.41)
  Top 0.254: U1.51 v28.5,46.86 | J9.32 17.27,70.77 15.5,69 15.5,55.06 17.41,53.15 v17.41,52.7
  Bottom 0.254: v28.5,46.86 28.5,48.35 27.01,49.84 25.31,49.84 23.13,52.02 18.1,52.02 v17.41,52.7
!TEMP_CS  (via drill 0.41)
  Top 0.254: U3.6 53.37,54.06 53,53.7 v52.56,53.7 52.63,53.63 TP2.TP | U1.29 41,50.5 43.08,52.58 43.08,53.92 43.43,54.28 v45.01,54.28
  Bottom 0.254: v45.01,54.28 45.59,53.7 v52.56,53.7
!TP_CS  (via drill 0.41)
  Top 0.254: U1.48 31.5,52.66 v30.8,53.37 | v17.12,55.44 17.12,67.9 J9.31
  Bottom 0.254: v30.8,53.37 30.04,54.13 18.41,54.13 17.12,55.42 v17.12,55.44
!TRST  (via drill 0.41)
  Top 0.254: J8.3 9.04,42.61 R20.1 9.15,41.64 9.83,40.96 12.36,40.96 13.36,39.95 16.33,39.95 v17.25,40.87 | U1.90 37.5,38.46 v37.94,38.89
  Bottom 0.254: v17.25,40.87 18.69,40.87 19.55,41.72 20.92,41.72 21.22,41.41 26.31,41.41 26.91,42.01 28.82,42.01 29.97,40.86 34.52,40.86 35.75,39.62 37.2,39.62 v37.94,38.89
!WR  (via drill 0.41)
  Top 0.254: U1.86 35.51,37.26 v35.78,37.53 | v32.07,38.47 31.89,38.65 v31.89,45.72 | J9.21 30.89,67.49 30.89,65.73 30.4,65.25 30.4,62.74 30.76,62.38 30.76,61.27 30.28,60.78 30.28,59.54 29.41,58.67 v29.41,52.76
  Bottom 0.254: v31.89,45.72 30.68,46.93 29.79,46.93 29.41,47.31 v29.41,52.76 | v32.07,38.47 33.01,37.53 v35.78,37.53
BAT  (via drill 0.41)
  Top 0.254: v65.38,31.22 63.52,31.22 SB1.3
  Bottom 0.254: v65.38,31.22 65.71,30.89 68.76,30.89 69.67,29.97 69.67,20.27 65.05,15.65 56.44,15.65 BAT1.PWR@1
BLU  (via drill 0.41)
  Top 0.254: U1.64 26.76,39.5 26.34,39.08 v25.54,39.08 | v37.01,29.1 37,29.09 R4.1 | v16.17,25.86 16.17,35.09 16.95,35.88 16.95,38.68 v17.18,38.91
  Bottom 0.254: v16.17,25.86 16.85,25.17 36.05,25.17 37.01,26.12 v37.01,29.1 | v25.54,39.08 17.35,39.08 v17.18,38.91
BTN1  (via drill 0.41)
  Top 0.254: v27.66,47.88 28.69,47.88 29.91,46.66 32.28,46.66 32.89,46.05 39.32,46.05 39.9,45.47 41.66,45.47 42.14,44.98 44.48,44.98 U1.23
  Top 0.813: J5.4 14.91,51.06 R7.2
  Bottom 0.254: J5.4 20.43,49.03 21.23,48.23 27.3,48.23 v27.66,47.88
BTN2  (via drill 0.41)
  Top 0.254: J4.2 61.34,46.49 R8.2 | U1.24 45.66,45.5 v46.1,45.94
  Bottom 0.254: v46.1,45.94 57.45,45.86 J4.2
BTN3  (via drill 0.41)
  Top 0.254: v7.3,40.36 7.3,39.81 7.9,39.22 R6.2 | U1.25 v42.47,46 | v41.07,44.2 39.26,44.2 v38.54,43.48
  Bottom 0.254: v7.3,40.36 7.3,43.65 7.61,43.95 J5.2 16.93,43.95 17.77,43.12 28.88,43.12 30.01,41.99 32.84,41.99 33.97,43.12 38.18,43.12 v38.54,43.48 | v41.07,44.2 42.47,44.88 v42.47,46
BTN4  (via drill 0.41)
  Top 0.254: J4.4 61.27,41.41 R9.2 62.97,41.66 63.56,42.25 63.56,49.14 v62.14,50.56 | U1.26 42.55,47.95 43.99,47.95 44.53,47.42 v45.96,47.42
  Bottom 0.254: v62.14,50.56 62.13,50.55 56.39,50.55 55.44,49.59 48.18,49.59 v45.96,47.42
BUZZER  (via drill 0.41)
  Top 0.254: U1.93 39,36.66 v39.73,37.39 | R30.1 57.35,27.1 | v50.95,31.42 52.63,29.74 55.14,29.74 57.35,27.53 R30.1 | TP4.TP 55.41,26.71 R30.1
  Bottom 0.254: v39.73,37.39 40.84,37.39 41.5,36.73 41.5,35.92 42.22,35.2 47.17,35.2 v50.95,31.42
D0  (via drill 0.41)
  Top 0.254: U1.61 27.14,41 v26.9,40.75 | v20.33,40.69 20.33,46.76 22.61,49.03 22.61,50.08 24.11,51.58 24.11,62.75 24.77,63.41 v25.53,63.41 | J9.3 53.01,67 51.87,65.86 50.8,65.86 45.07,60.13 v41.59,60.13 | J9.3
  Bottom 0.254: v26.9,40.75 25.46,40.75 25.4,40.69 v20.33,40.69 | v41.59,60.13 41.59,60.76 37.1,65.25 30.47,65.25 29.1,63.88 25.98,63.88 25.53,63.42 v25.53,63.41
D1  (via drill 0.41)
  Top 0.254: J9.4 51.74,69.5 51.74,67.55 51.16,66.97 49.82,66.97 44.27,61.42 40.08,61.42 39.29,60.63 39.29,59.51 39.45,59.36 39.45,53.92 v39.24,53.72 | U1.62 29.5,40.5 v30.12,39.88 | v32.66,40.03 32.66,42.76 34.43,44.53 v35.22,44.53
  Bottom 0.254: v30.12,39.88 32.51,39.88 v32.66,40.03 | v39.24,53.72 37.47,53.72 36.73,52.98 36.73,45.23 36.03,44.53 v35.22,44.53
D2  (via drill 0.41)
  Top 0.254: U1.81 33,37.65 33.33,37.97 33.33,38.91 34.11,39.7 34.11,42.19 35.03,43.1 36.08,43.1 v37.19,44.21
  Bottom 0.254: v37.19,44.21 37.41,44.21 39.17,45.96 39.17,51.87 41.22,53.92 42.82,53.92 46.3,57.4 46.3,63.48 50.47,67.64 J9.5
D3  (via drill 0.41)
  Top 0.254: U1.82 33.5,33.32 34.38,34.2 34.38,38.19 35.38,39.19 35.38,41.27 v35.81,41.71 | v57.86,54.37 v57.86,61.9
  Bottom 0.254: J9.6 51.86,72.16 56.57,72.16 57.87,70.85 57.87,64.26 57.86,64.25 v57.86,61.9 | v35.81,41.71 36.12,42.01 38.84,42.01 39.85,43.03 39.85,48.21 39.92,48.27 42.77,51.13 54.63,51.13 57.86,54.36 v57.86,54.37
D4
  Top 0.254: U1.38 36.5,61.52 37.21,62.23 38.56,62.23 39.32,62.99 43.34,62.99 47.93,67.58 J9.7
D5
  Top 0.254: U1.39 36,62.02 36.85,62.88 38.23,62.88 38.96,63.61 42.69,63.61 46.66,67.59 46.66,69.5 J9.8
D6
  Top 0.254: U1.40 35.5,62.55 36.46,63.51 37.85,63.51 38.62,64.29 42.06,64.29 45.39,67.61 J9.9
D7
  Top 0.254: U1.41 35,63.03 36.14,64.17 37.57,64.17 38.32,64.92 41.45,64.92 44.12,67.59 44.12,69.5 J9.10
D8
  Top 0.254: U1.42 34.5,63.58 35.79,64.87 37.25,64.87 37.99,65.61 40.88,65.61 42.85,67.58 J9.11
D9
  Top 0.254: U1.43 34,64.19 35.4,65.58 36.88,65.58 37.59,66.29 40.28,66.29 41.57,67.58 41.57,69.49 J9.12
D10
  Top 0.254: U1.44 33.5,64.78 35.03,66.31 36.51,66.31 37.16,66.95 39.03,66.95 J9.13
D11
  Top 0.254: U1.45 33,65.33 34.63,66.97 35.87,66.97 36.52,67.63 36.52,68.87 37.16,69.51 39.05,69.51 J9.14
D12  (via drill 0.41)
  Top 0.254: U1.46 32.5,66.14 33.96,67.6 v33.96,69.51
  Bottom 0.254: v33.96,69.51 36.49,69.51 J9.15
D13  (via drill 0.41)
  Top 0.254: U1.55 29.73,44 v30.29,44.56
  Bottom 0.254: J9.16 37.77,70.54 39.03,69.28 39.03,66.22 43.61,61.63 43.61,57.07 42.06,55.52 42.06,55.5 33.76,55.5 32.75,54.5 32.75,45.07 32.24,44.56 v30.29,44.56
D14  (via drill 0.41)
  Top 0.254: U1.56 27.5,43.5 27.11,43.12 26.49,43.12 25.65,43.95 25.65,45.26 26.36,45.97 26.36,49.89 v27.19,50.71 | v27.66,53.23 27.66,58.85 28.7,59.89 28.7,61.01 29.41,61.72 29.41,62.94 29.29,63.07 29.29,65.67 v30.15,66.53
  Bottom 0.254: v30.15,66.53 33.53,66.53 J9.17 | v27.19,50.71 27.19,52.76 v27.66,53.23
D15  (via drill 0.41)
  Top 0.254: U1.57 27.66,43 27.19,42.53 26.28,42.53 25.07,43.74 25.07,45.59 25.81,46.33 25.81,50.86 v25.59,51.08 | J9.18 33.88,72.12 27.03,72.12 26.33,71.42 26.33,67.59 26.98,66.94 26.98,59.87 25.79,58.69 v25.79,53.23
  Bottom 0.254: v25.59,51.08 25.59,53.02 v25.79,53.23
DBG1  (via drill 0.41)
  Top 0.254: R25.1 22,28.84 20.88,29.96 20.88,39.97 21.2,40.28 21.2,41.95 v21.46,42.22 | v25.68,42.11 25.79,42 U1.59
  Bottom 0.254: v21.46,42.22 25.58,42.22 v25.68,42.11
DBG2
  Top 0.254: U1.60 26.6,41.5 23.8,38.7 23.8,30.89 24.5,30.19 R26.1
GND  (via drill 0.41)
  Top 0.254: U1.99 42,32.93 42.29,33.22 | 42.29,33.22 44.63,33.22 | U1.74 27.17,34.5 27.06,34.39 | C12.2 28.5,29.39 28.12,29.01 | U1.49 31,50.01 31.04,50.05 31.04,51.23 30.92,51.35 C11.2 | U1.20 43.23,43.5 43.22,43.51 | U1.10 43.11,38.5 41.63,37.02 41.63,33.88 42.29,33.22 | 46.48,46.94 46.9,47.36 | BUZZER.2 63.7,22.05 v63.7,13.06 | U1.27 42,49.29 42.04,49.33
  Bottom 0.254: v31.33,59.78 26.66,59.78 v25.54,60.9 | BAT1.GND 61.11,10.46 v63.7,13.06
  pour Top: 70,0 arc90 73,3 73,70 arc90 70,73 3,73 arc90 0,70 0,3 arc90 3,0
GRN  (via drill 0.41)
  Top 0.254: R5.1 39.2,28.65 38.27,28.65 37.92,28.99 37.92,29.67 37.62,29.97 36.42,29.97 35.99,29.54 35.99,29.17 35.79,28.97 33.02,28.97 31.69,27.64 v31.69,26.45 | v26.47,38.18 27.29,39 U1.65 | v17.72,37.96 17.72,35.65 17.06,34.99 v17.06,26.67
  Bottom 0.254: v31.69,26.45 31.32,26.09 17.54,26.09 17.06,26.57 v17.06,26.67 | v26.47,38.18 17.93,38.18 v17.72,37.96
INT  (via drill 0.41)
  Top 0.254: J9.24 28.87,69.51 28.87,67.56 28.19,66.89 v28.19,62.34 | U1.34 38.5,48.86 39.01,49.38 39.01,52.78 38,53.8 38,59.44 v37.9,59.54
  Bottom 0.254: v37.9,59.54 34.05,59.54 31.94,61.65 28.89,61.65 v28.19,62.34
LED1  (via drill 0.41)
  Top 0.254: U1.97 41,35.17 v40.4,35.78 | v30.47,45.88 31.37,44.98 31.37,39.09 30.54,38.27 v30.54,38.25
  Bottom 0.254: v30.47,45.88 22.19,45.88 21.58,46.49 19.55,46.49 19,47.04 15.46,47.04 J5.3 | v30.54,38.25 30.57,38.25 32.68,36.14 40.01,36.14 40.37,35.78 v40.4,35.78
LED2  (via drill 0.41)
  Top 0.254: 59.73,50.67 J4.1 | 59.73,50.67 61.1,52.05 63.86,52.05 65.66,50.24 65.66,42.37 63.03,39.74 v62.37,39.74 | 59.73,50.67 | U1.98 41.5,30.99 v42.98,29.52 | v46.91,28.32 v53.92,28.32
  Bottom 0.254: v46.91,28.32 44.17,28.32 v42.98,29.52 | v62.37,39.74 59.6,39.74 58.27,38.41 58.27,29.97 57.56,29.26 54.86,29.26 v53.92,28.32
LED3  (via drill 0.41)
  Top 0.254: U1.1 v42.51,34 | v17.88,34.72 17.88,35 18.63,35.75 18.63,39.09 18.15,39.57 18.15,41.45 v17.69,41.91
  Bottom 0.254: v17.88,34.72 17.97,34.63 39.2,34.63 39.45,34.87 41.63,34.87 v42.51,34 | v17.69,41.91 15.4,41.91 J5.1
LED4  (via drill 0.41)
  Top 0.254: U1.2 45.46,34.5 v46.29,33.67
  Bottom 0.254: J4.3 56.78,43.95 55.47,42.65 55.47,33.83 51.49,29.84 50.11,29.84 v46.29,33.67 | J4.3
LED_COM_BLU
  Top 0.254: J6.3 37.77,25.38 R4.2
LED_COM_GRN
  Top 0.254: J6.4 40.31,25.84 R5.2
LED_COM_RED
  Top 0.254: J6.2 35.23,24.92 R3.2
N$1
  Top 0.254: X1.1 | R29.2 48.64,41.77 48.64,45.49 50.2,47.05 X1.1 | C1.1 53.66,48.87 50.88,48.87 50.23,48.22 X1.1
N$2  (via drill 0.41)
  Top 0.254: C2.1 X1.3 52.64,42.66 52.64,44.01 52.18,44.46 v51.61,44.46 | U1.12 41.45,39.5 v40.66,40.28
  Bottom 0.254: v40.66,40.28 40.66,40.74 41.81,41.88 43.59,41.88 46.16,44.46 v51.61,44.46
N$3  (via drill 0.41)
  Top 0.254: J7.2 5.14,10.68 v6.06,11.6 | v6.91,15.19 8.85,17.13 8.85,19.41 9.45,20 R10.2
  Bottom 0.254: v6.06,11.6 6.06,14.34 v6.91,15.19
N$4
  Top 0.254: J7.6 5.65,22.5 R11.2
N$5  (via drill 3)
  other vias: 69.5,3.5
N$6
  Top 0.254: J8.11 8.92,52.77 R17.2
N$7
  Top 0.254: J8.17 9.04,60.39 R18.2
N$8
  Top 0.254: J8.19 9.08,62.93 R19.2
N$9
  Top 0.406: J10.ID 10.46,30.7 12.14,29.02 R21.2
N$10
  Top 0.406: J10.D- 10.45,32.3 R22.2
N$11
  Top 0.406: J10.D+ R23.2
N$12  (via drill 3)
  other vias: 3.5,3.5
N$13
  Top 0.813: D1.A R24.2
N$14
  Top 0.813: D2.A R25.2
N$15
  Top 0.813: D3.A R26.2
N$16
  Top 0.254: X2.1 53.99,33.32 | R27.2 56.4,34.01 54.44,34.01 X2.1 | C6.1 53.75,32.6 X2.1
N$17  (via drill 3)
  other vias: 69.5,69.5
N$18  (via drill 3)
  other vias: 3.5,69.5
N$19
  Top 0.254: R28.1 37.74,50.18 37.74,49.51 37.49,49.25 37.34,49.25 37.01,48.92 U1.37
N$20  (via drill 0.41)
  Top 0.406: v1.45,30.35 3.02,31.93 5.44,31.93 6.6,33.1 J10.VBUS | v1.5,6.68 1.85,6.33 7.21,6.33 8.27,7.38 D4.A
  Bottom 0.406: v1.45,30.35 1.5,30.3 v1.5,6.68
N$21
  Top 0.406: D5.A 22.92,2.65 J1.1
N$22
  Top 0.406: J7.3 D6.A
N$23
  Top 0.254: R29.1 47.84,39.27 46.13,39.27 45.4,40 U1.13
N$24
  Top 0.254: R30.2 C16.1
N$25
  Top 0.254: U1.21 U1.22 47.12,44.5 L1.1 47.37,44.91 47.37,46.79 48.06,47.47 C4.+ 49.86,49.78 C3.1
N$27
  Top 0.254: 63.71,8.05 BUZZER.1 69.55,13.89 69.55,27.74 68.1,29.18 D8.C 63.77,29.18 D7.C 61.29,26.71 C16.2
OSC32_IN
  Top 0.254: U1.8 45.49,37.49 46.43,36.55 46.43,35.31 48.01,33.73 C5.1 48.55,33.32 X2.4
OSC32_OUT
  Top 0.254: U1.9 45.8,38 47.22,36.58 50.55,36.58 51.46,35.66 56.17,35.66 R27.1
RED  (via drill 0.41)
  Top 0.254: 33.99,27.84 R3.1 33.17,27.85 32.85,27.53 32.85,25.41 32.58,25.13 31.97,25.13 v31.3,24.47 | U1.63 v26.16,39.99 | v15.3,38.04 15.32,38.02 v15.32,24.92
  Bottom 0.254: v26.16,39.99 17.04,39.99 15.3,38.25 v15.3,38.04 | v31.3,24.47 15.76,24.47 v15.32,24.92
RS  (via drill 0.41)
  Top 0.254: U1.58 29.84,42.5 v30.35,43.02
  Bottom 0.254: J9.20 34.04,72.12 40.87,72.12 41.57,71.42 41.57,66.76 41.55,66.75 44.86,63.45 44.86,57.38 42.42,54.94 34.8,54.94 33.59,53.73 33.59,44.48 32.13,43.02 v30.35,43.02
RX  (via drill 0.41)
  Top 0.254: U1.69 30.35,37 31.1,36.25 31.1,34.37 v30.53,33.8
  Bottom 0.254: J7.4 5.86,15.77 7.66,17.56 7.66,22.92 6.86,23.72 6.86,30.38 8.93,32.45 13.89,32.45 15.11,33.67 30.4,33.67 v30.53,33.8
SPI1_MISO  (via drill 0.41)
  Top 0.254: U3.7 v54.63,53.19 55.96,53.19 TP1.TP | U1.31 40.01,51.33 41.24,52.56 v41.59,52.93
  Bottom 0.254: v54.63,53.19 53.82,52.38 42.14,52.38 v41.59,52.92 v41.59,52.93
SPI1_SCK
  Top 0.254: U1.30 40.5,50.74 42.57,52.81 42.57,54.56 44.42,56.41 51.03,56.41 52.02,55.43 U3.5 51.46,54.79 TP3.TP
SPI2_MISO  (via drill 0.41)
  Top 0.254: J9.25 21.22,64.38 21.23,64.37 21.23,53.25 19.52,51.54 19.52,50.51 18.05,49.03 v18.05,45.7 | U1.53 v26.81,45
  Bottom 0.254: v26.81,45 18.75,45 v18.05,45.7
SPI2_MOSI  (via drill 0.41)
  Top 0.254: J9.27 20.45,66.15 20.45,53.54 18.49,51.59 18.49,50.58 17.16,49.25 17.16,45.16 v17.82,44.5 | U1.54 27.36,44.5 v26.81,43.95
  Bottom 0.254: v26.81,43.95 18.36,43.95 v17.82,44.5
SPI2_SCK  (via drill 0.41)
  Top 0.254: U1.52 27.51,45.5 27.25,45.76 v27.25,46.79 | v19.62,48.3 21.13,49.81 21.13,50.85 22.7,52.41 v22.7,61.72 | v19.55,63.72 19.55,67.78 J9.29
  Bottom 0.254: v27.25,46.79 26.39,47.65 20.27,47.65 v19.62,48.3 | v22.7,61.72 22.7,62.46 21.88,63.27 19.99,63.27 v19.55,63.72
SSR
  Top 0.254: U1.95 40,29.39 40.49,28.91 41.2,28.91 41.66,28.45 41.66,24.82 42.27,24.21 42.27,21.59 40.87,20.19 40.01,20.19 38.99,19.18 38.99,17.32 39.76,16.55 R15.1 41.06,9.77 43.99,6.83 J3.1
T+  (via drill 0.41)
  Top 0.254: v60.6,35.92 61.67,36.98 v65.25,36.98 | U3.3 53.37,62.97 53.76,63.36 54.48,63.36 55.93,64.81 55.93,66.04 58.43,68.54 58.43,68.56 v63.06,68.56 | v46.58,15.33 53.1,15.33 54.41,16.64 v54.41,23.15
  Bottom 0.254: v65.25,36.98 67.11,38.84 67.11,67.26 65.82,68.54 v63.07,68.54 v63.06,68.56 | v46.58,15.33 39,7.75 J2.2 | v54.41,23.15 54.41,24.59 55.7,25.88 59.36,25.88 60.6,27.13 v60.6,35.92
T-  (via drill 0.41)
  Top 0.254: U3.2 54.63,62.48 54.7,62.48 59.03,66.81 v64.63,66.81 | v43.46,17.32 44.2,17.32 45.34,18.47 48.31,18.47 v49.76,19.91 | v37,17.35 34,14.35 J2.1
  Bottom 0.254: v43.46,17.32 37.02,17.32 v37,17.35 | v64.63,66.81 65.79,65.66 65.79,40.62 62.18,37.01 v62.18,29.79 62.18,21.64 60.45,19.91 v49.76,19.91
TCK  (via drill 0.41)
  Top 0.254: J8.9 8.88,50.23 R12.1 9.14,51.18 9.77,51.8 v12.59,51.8 | U1.76 v30.49,30.64 | v21.58,32.84 21.58,39.78 21.91,40.11 21.91,41.43 22.24,41.76 22.24,42.67 21.77,43.14 21.31,43.14 20.95,43.5 20.95,46.39 23.75,49.19 v23.75,49.54
  Bottom 0.254: v30.49,30.64 28.3,32.84 v21.58,32.84 | v12.59,51.8 13.55,50.84 22.66,50.84 23.75,49.75 v23.75,49.54
TDI  (via drill 0.41)
  Top 0.254: U1.77 31,33.08 v31.8,33.88 | J8.5 9,45.15 R14.1 | v4.76,34.77 4.76,37.4 3.96,38.2 v3.94,38.2 | v3.94,30.19 3.94,29.03 4.84,28.13 6.17,28.13 6.79,28.75 v9.89,28.75
  Bottom 0.254: v31.8,33.88 31.8,29.64 29.88,27.72 19.76,27.72 18.73,28.75 v9.89,28.75 | J8.5 5.25,45.15 3.94,43.84 v3.94,38.2 | v3.94,30.19 3.65,30.48 3.65,33.66 v4.76,34.77
TDO  (via drill 0.41)
  Top 0.254: J8.13 8.96,55.31 R16.1 9.15,56.6 9.51,56.96 v13.12,56.96 | U1.89 37,40.34 37.19,40.53 v38.89,40.53 | v41.58,56.77 42.06,56.77 42.98,57.68 47.65,57.68 v48.13,58.17 | v45.02,48.77 45.62,48.77 46.3,49.45 46.3,54.63 46.79,55.12 v48.13,55.12
  Bottom 0.254: v45.02,48.77 43.5,47.24 43.5,43.88 42.6,42.98 41.34,42.98 v38.89,40.53 | v13.12,56.96 13.91,57.75 20.12,57.75 21.11,56.76 41.57,56.76 v41.58,56.77 | v48.13,58.17 v48.13,55.12
TMS  (via drill 0.41)
  Top 0.254: R13.1 8.96,47.69 J8.7 3.98,46.4 3.99,46.38 3.99,39.22 5.28,37.92 5.28,35.67 7,33.96 v10.26,33.96 | U1.72 28.52,35.48 29.54,35.48 v30.19,35.47
  Bottom 0.254: v10.26,33.96 13.86,33.96 15.65,35.75 18.3,35.75 18.58,35.47 v30.19,35.47
TX  (via drill 0.41)
  Top 0.254: U1.68 28.48,37.48 v27.15,37.48
  Bottom 0.254: v27.15,37.48 26.76,37.48 26.58,37.3 5.65,37.3 2.65,34.3 2.65,25.69 6.25,22.1 6.25,19.2 5.36,18.31 J7.5
USBDM  (via drill 0.41)
  Top 0.254: R22.1 13.88,34.03 v13.88,35.55 | v26.73,36.5 U1.70
  Bottom 0.254: v13.88,35.55 14.83,36.5 v26.73,36.5
USBDP  (via drill 0.41)
  Top 0.254: R23.1 13.89,31.46 v13.89,29.95 | U1.71 27.61,36.01 25.59,33.98 v25.59,31.46
  Bottom 0.254: v25.59,31.46 19.09,31.46 17.58,29.95 v13.89,29.95
VBAT  (via drill 0.41)
  Top 0.254: v42.49,36.5 U1.6 | v42.49,36.5 | SB1.2 60.05,32.94 58.65,34.34 58.65,36.2 57.84,37.01 v52.15,37.01
  Bottom 0.254: v42.49,36.5 51.64,36.5 v52.15,37.01
VDD  (via drill 0.41, 0.81)
  Top 0.254: C12.1 U1.75 | U3.4 52.15,61.63 C14.2 55.55,67.9 J9.1 57.8,70.48 63.91,70.48 69.85,64.54 SW2.4 | R20.2 12.57,42.5 v12.61,42.55 | C12.1 28.51,31.84 | v41.69,38.3 42.39,39 U1.11 44.51,38.99 45.64,38.99 47.21,37.43 C13.1 | 44.59,30.01 v44.12,30.48 44.12,31.97 C9.1 44.08,32 U1.100 | C15.+ 44.59,30.01 | R2.2 v64.08,56.5 | 44.59,30.01 44.6,30 | U1.28 41.5,49.55 41.86,49.91 v43.36,49.91 44.22,49.91 C10.1 | R16.2 12.52,55.5 v13.51,54.51 | R12.2 R13.2 12.17,47.5 v12.5,47.83 | R14.2 12.11,45 v12.47,45.36 | C12.1 27.73,31.85 26.85,30.96 26.85,30.38 v26.47,30 | C17.1 62.7,33.84 SB1.1 62.62,33.77 62.62,34.84 63.25,35.46 v64.62,35.46 | L1.2 46.92,42.81 v46.43,42.32 | U1.50 30.24,48 C11.1 29.27,49.27 v30.26,50.27
  Top 0.406: SW2.4 SW2.3 | v19,21.73 arc-90 v19,21.73 R24.1
  Top 0.813: C8.1 15.5,6.94 U2.3 18.16,7.12 v18.19,7.15
  pour Bottom: 70,0 arc90 73,3 73,70 arc90 70,73 3,73 arc90 0,70 0,3 arc90 3,0
VIN  (via drill 0.41, 0.81)
  Top 0.254: D5.C 19.36,5.38 v20.34,6.38
  Top 0.406: 9.62,3.85 D4.C | D6.C 11.12,8.12 U2.1
  Top 0.813: U2.1 11.5,6.74 C7.1 9.62,3.85 v9.5,3.73
  Bottom 0.254: v20.34,6.38 17.7,3.73 v9.5,3.73

### Text on the board
tPlace: 1 | RST | BOOT | + | 1 | http://bit.ly/ibU33m | VBAT | VDD | BAT | GRN | PWR | GND | BLK | Toaster Brain v2 | stephen caudle | mike spradling | VIN | GND | T- | T+ | SSR | GND